# EAGLE design volume (EAGLE 6.4)
PyRadio
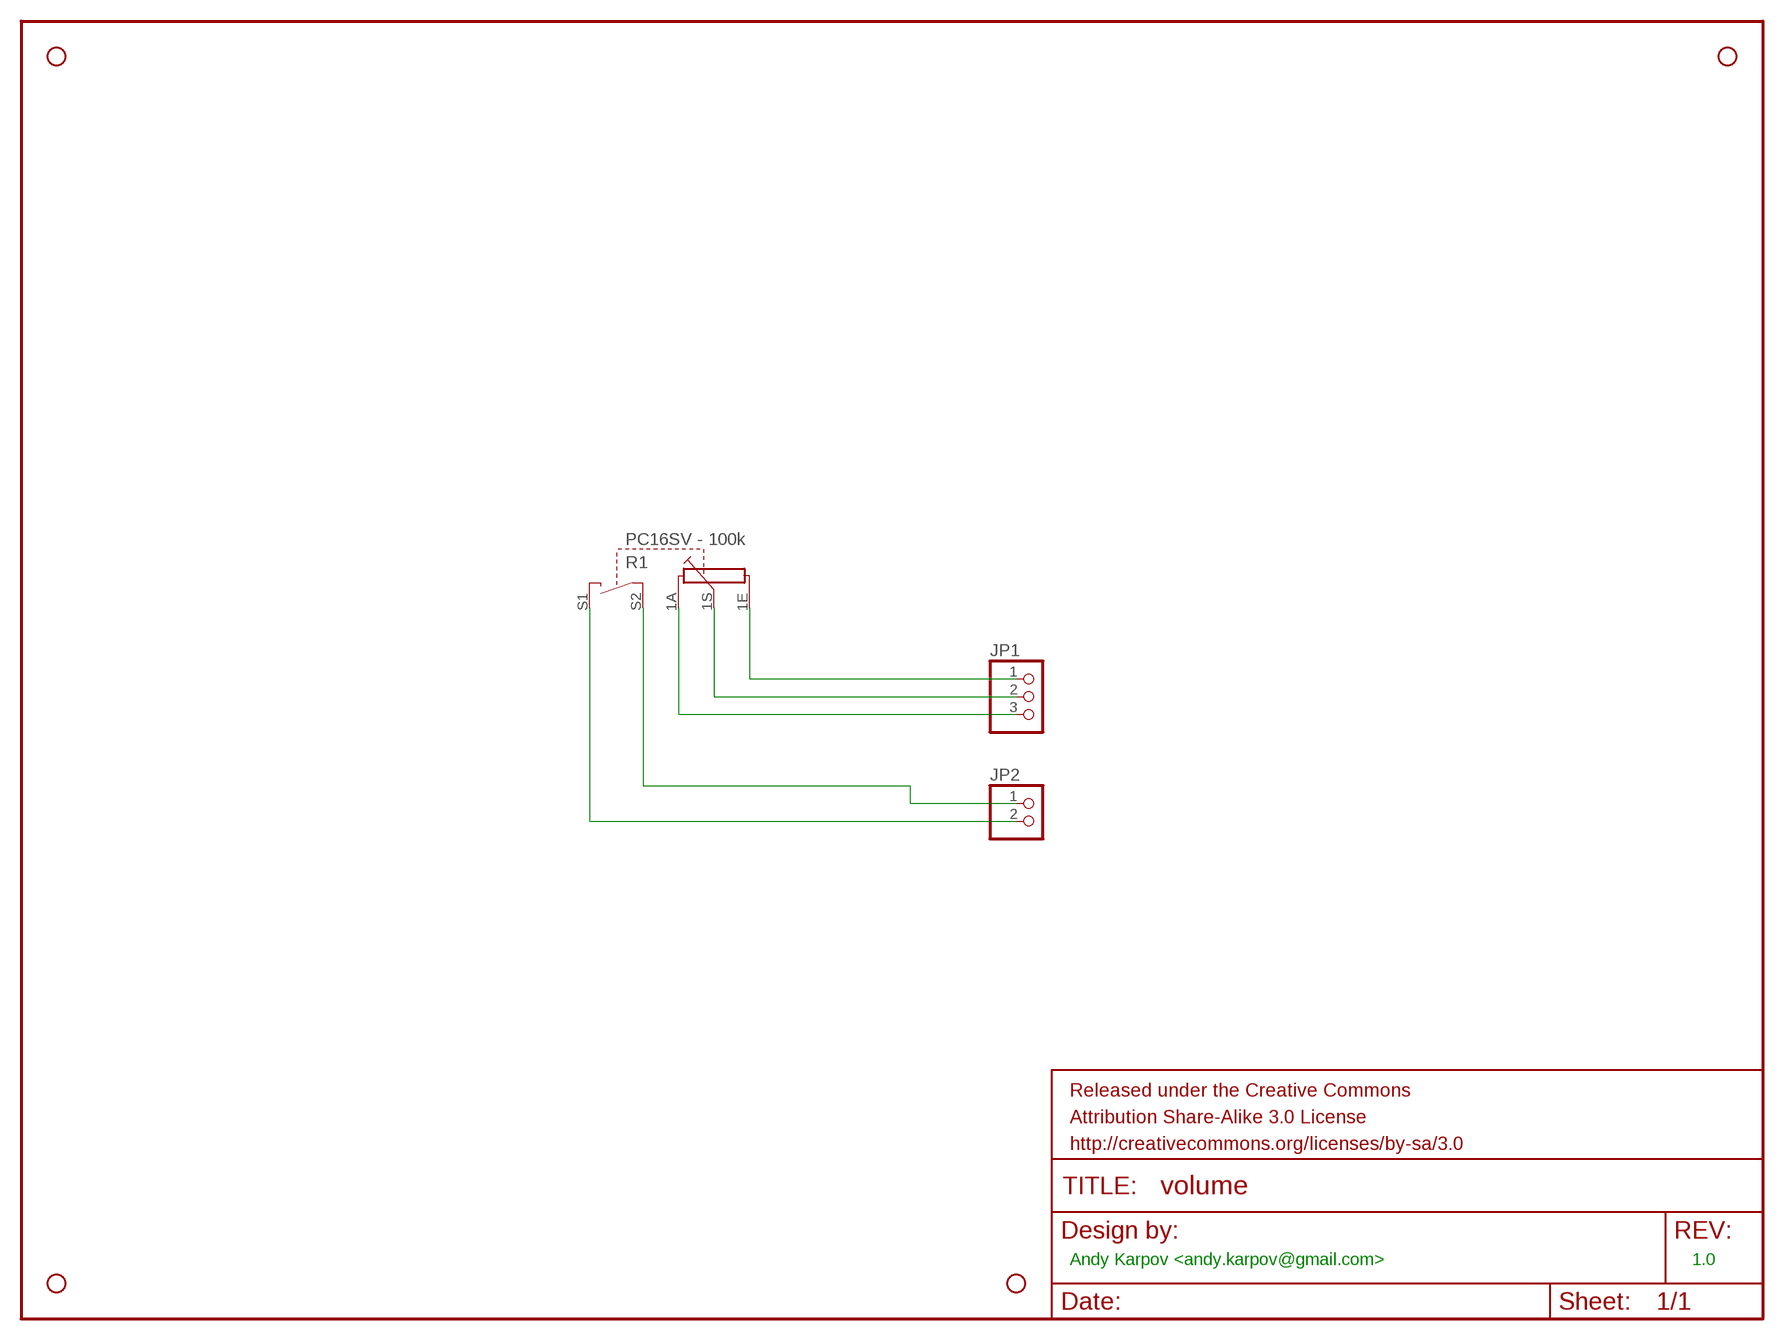
[diagram p0: schematic, sheet 1]

## Parts
FRAME1  FRAME-LETTER  [CREATIVE_COMMONS]
JP1  PINHD-1X3  [1X03]
JP2  PINHD-1X2  [1X02]
R1  PC16SV - 100k  PC16SV  [PC16SV]
STANDOFF1  STAND-OFF  [STAND-OFF]
STANDOFF2  STAND-OFF  [STAND-OFF]
STANDOFF3  STAND-OFF  [STAND-OFF]
STANDOFF4  STAND-OFF  [STAND-OFF]

## Nets
N$1: JP1.1 R1.1E
N$2: JP1.2 R1.1S
N$3: JP1.3 R1.1A
N$4: JP2.1 R1.S2
N$5: JP2.2 R1.S1

## Notes on the sheet
- Andy Karpov <andy.karpov@gmail.com> | 1.0

## Library data of the parts
FRAME1 = SparkFun-Aesthetics:FRAME-LETTER: Schematic Frame Standard 8.5x11 US Letter frame
JP1 = pinhead:PINHD-1X3: PIN HEADER
JP2 = pinhead:PINHD-1X2: PIN HEADER
R1 = piher:PC16SV: POTENTIOMETER vertical single carbon potentiometer with switch, 16 mm; OC_FARNELL: unknown; OC_NEWARK: unknown
STANDOFF1-STANDOFF4 = SparkFun-Electromechanical:STAND-OFF: #4 Stand Off This is the mechanical footprint for a #4 phillips button head screw. Use the keepout ring to avoid running the screw head into surrounding components. SKU : PRT-00447

## Board
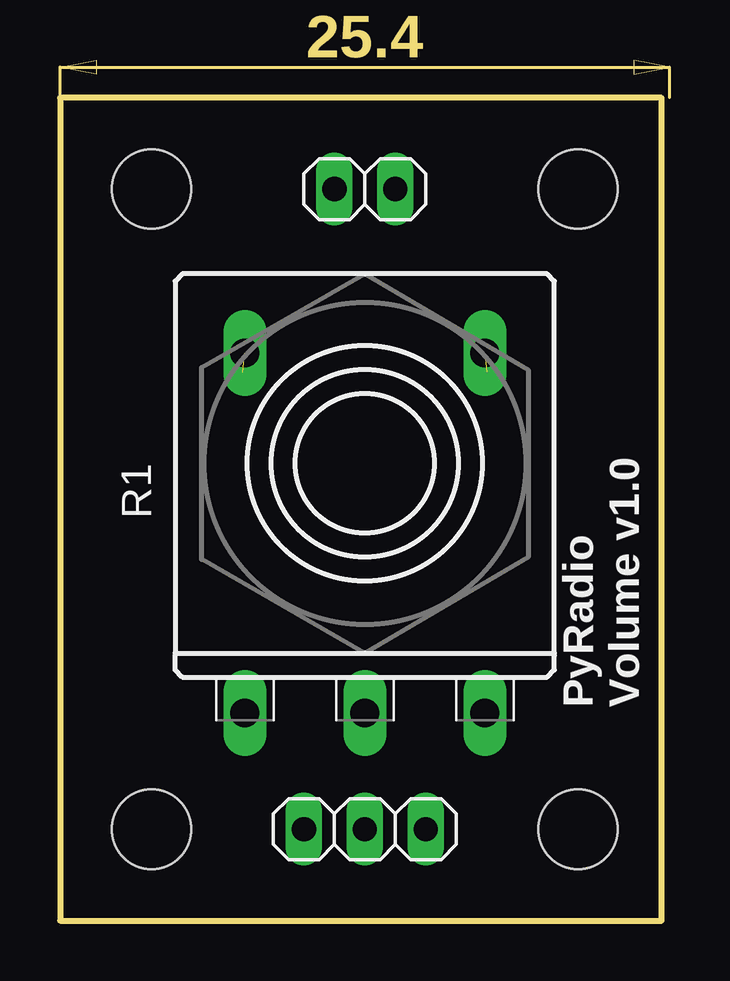
[diagram p1: board, top side]
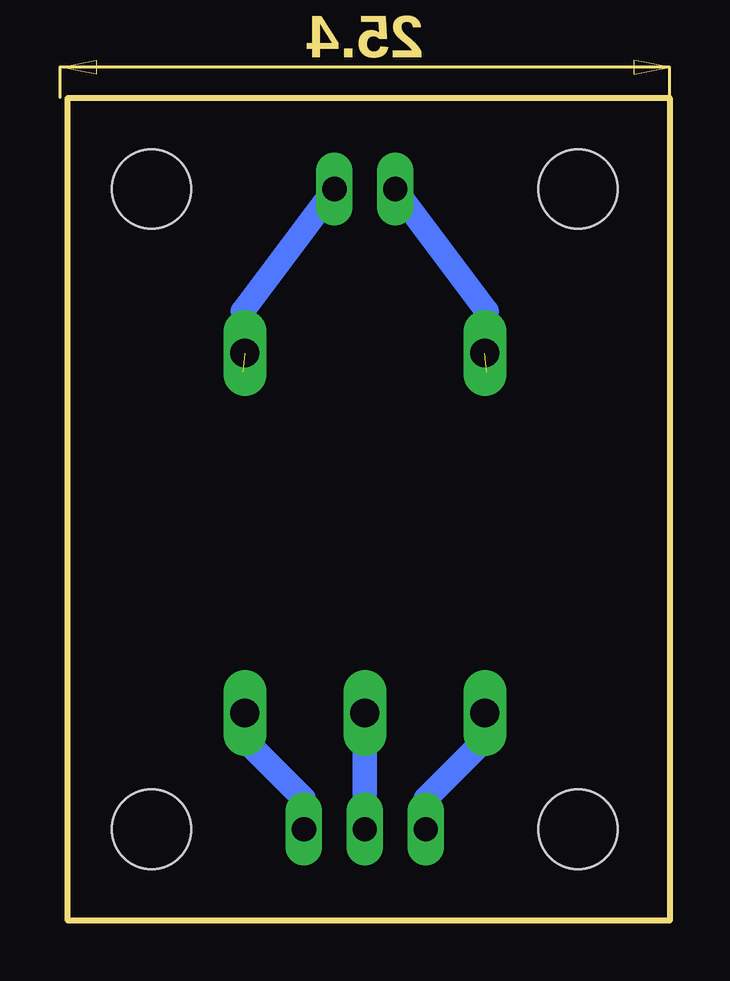
[diagram p2: board, bottom side, seen from below]

Size 25.07 x 34.28 mm. Coordinates in mm from the lower left corner, seen from the top.
Outline: 0,0 25.07,0 25.07,34.28 0,34.28 0,0
Copper layers (1*16): Top 0.035mm / dielectric 1.5mm / Bottom 0.035mm
Design rules "default": minimum track width 10mil, minimum drill 24mil, track to track 8mil, track to pad 8mil, pad to pad 8mil, via to via 8mil, smd to smd 8mil, copper to edge 40mil, drill to drill 8mil, minimum pad ring 10mil, minimum via ring 8mil, stop-mask expansion 4mil, vias tented up to drill 0mil, thermal gap 10mil

### Footprints (pad centres in the part's own frame; a part is rotated, then mirrored left to right if it is on the bottom)
1X03 = drill 1.016 long: 1 -2.54,0; 2 0,0; 3 2.54,0
1X02 = drill 1.016 long: 1 -1.27,0; 2 1.27,0
PC16SV = drill 1.2 long: 1A -5,10.4; 1E 5,10.4; 1S 0,10.4; S1 -5,-4.6; S2 5,-4.6
STAND-OFF = hole 3.302: 0,0

### Placement (x,y rotation side)
FRAME1  20.32,35.56 0 top
JP1  12.7,3.81 0 top
JP2  12.7,30.48 0 top
R1  12.7,19.05 180 top
STANDOFF1  21.59,3.81 0 top
STANDOFF2  3.81,3.81 0 top
STANDOFF3  3.81,30.48 0 top
STANDOFF4  21.59,30.48 0 top

### Tracks (layer width: path | path; a pad name or v marks a point on that pad's centre or on a via)
N$1
  Bottom 0.254: 10.16,5.08 JP1.1
  Bottom 0.61: 7.62,7.62 R1.1E
  Bottom 1.016: 7.62,7.62 10.16,5.08
N$2
  Bottom 0.254: 12.7,7.62 R1.1S
  Bottom 1.016: R1.1S JP1.2
N$3
  Bottom 0.254: 15.24,5.08 JP1.3
  Bottom 0.61: 17.78,7.62 R1.1A
  Bottom 1.016: 17.78,7.62 15.24,5.08
N$4  (1 unrouted)
  Bottom 0.61: 7.62,22.86 7.62,25.4
  Bottom 1.016: 7.62,25.4 JP2.1
N$5  (1 unrouted)
  Bottom 0.61: 17.78,25.4 17.78,22.86
  Bottom 1.016: JP2.2 17.78,25.4

### Text on the board
tPlace: PyRadio / Volume v1.0